# EasyEDA schematic SCH_power_LED_2026-05-29.json
TITLE: lepiTORCH; REV: 1.1; Date: 2026-05-20; Sheet: 1/1; Drawn By: eric
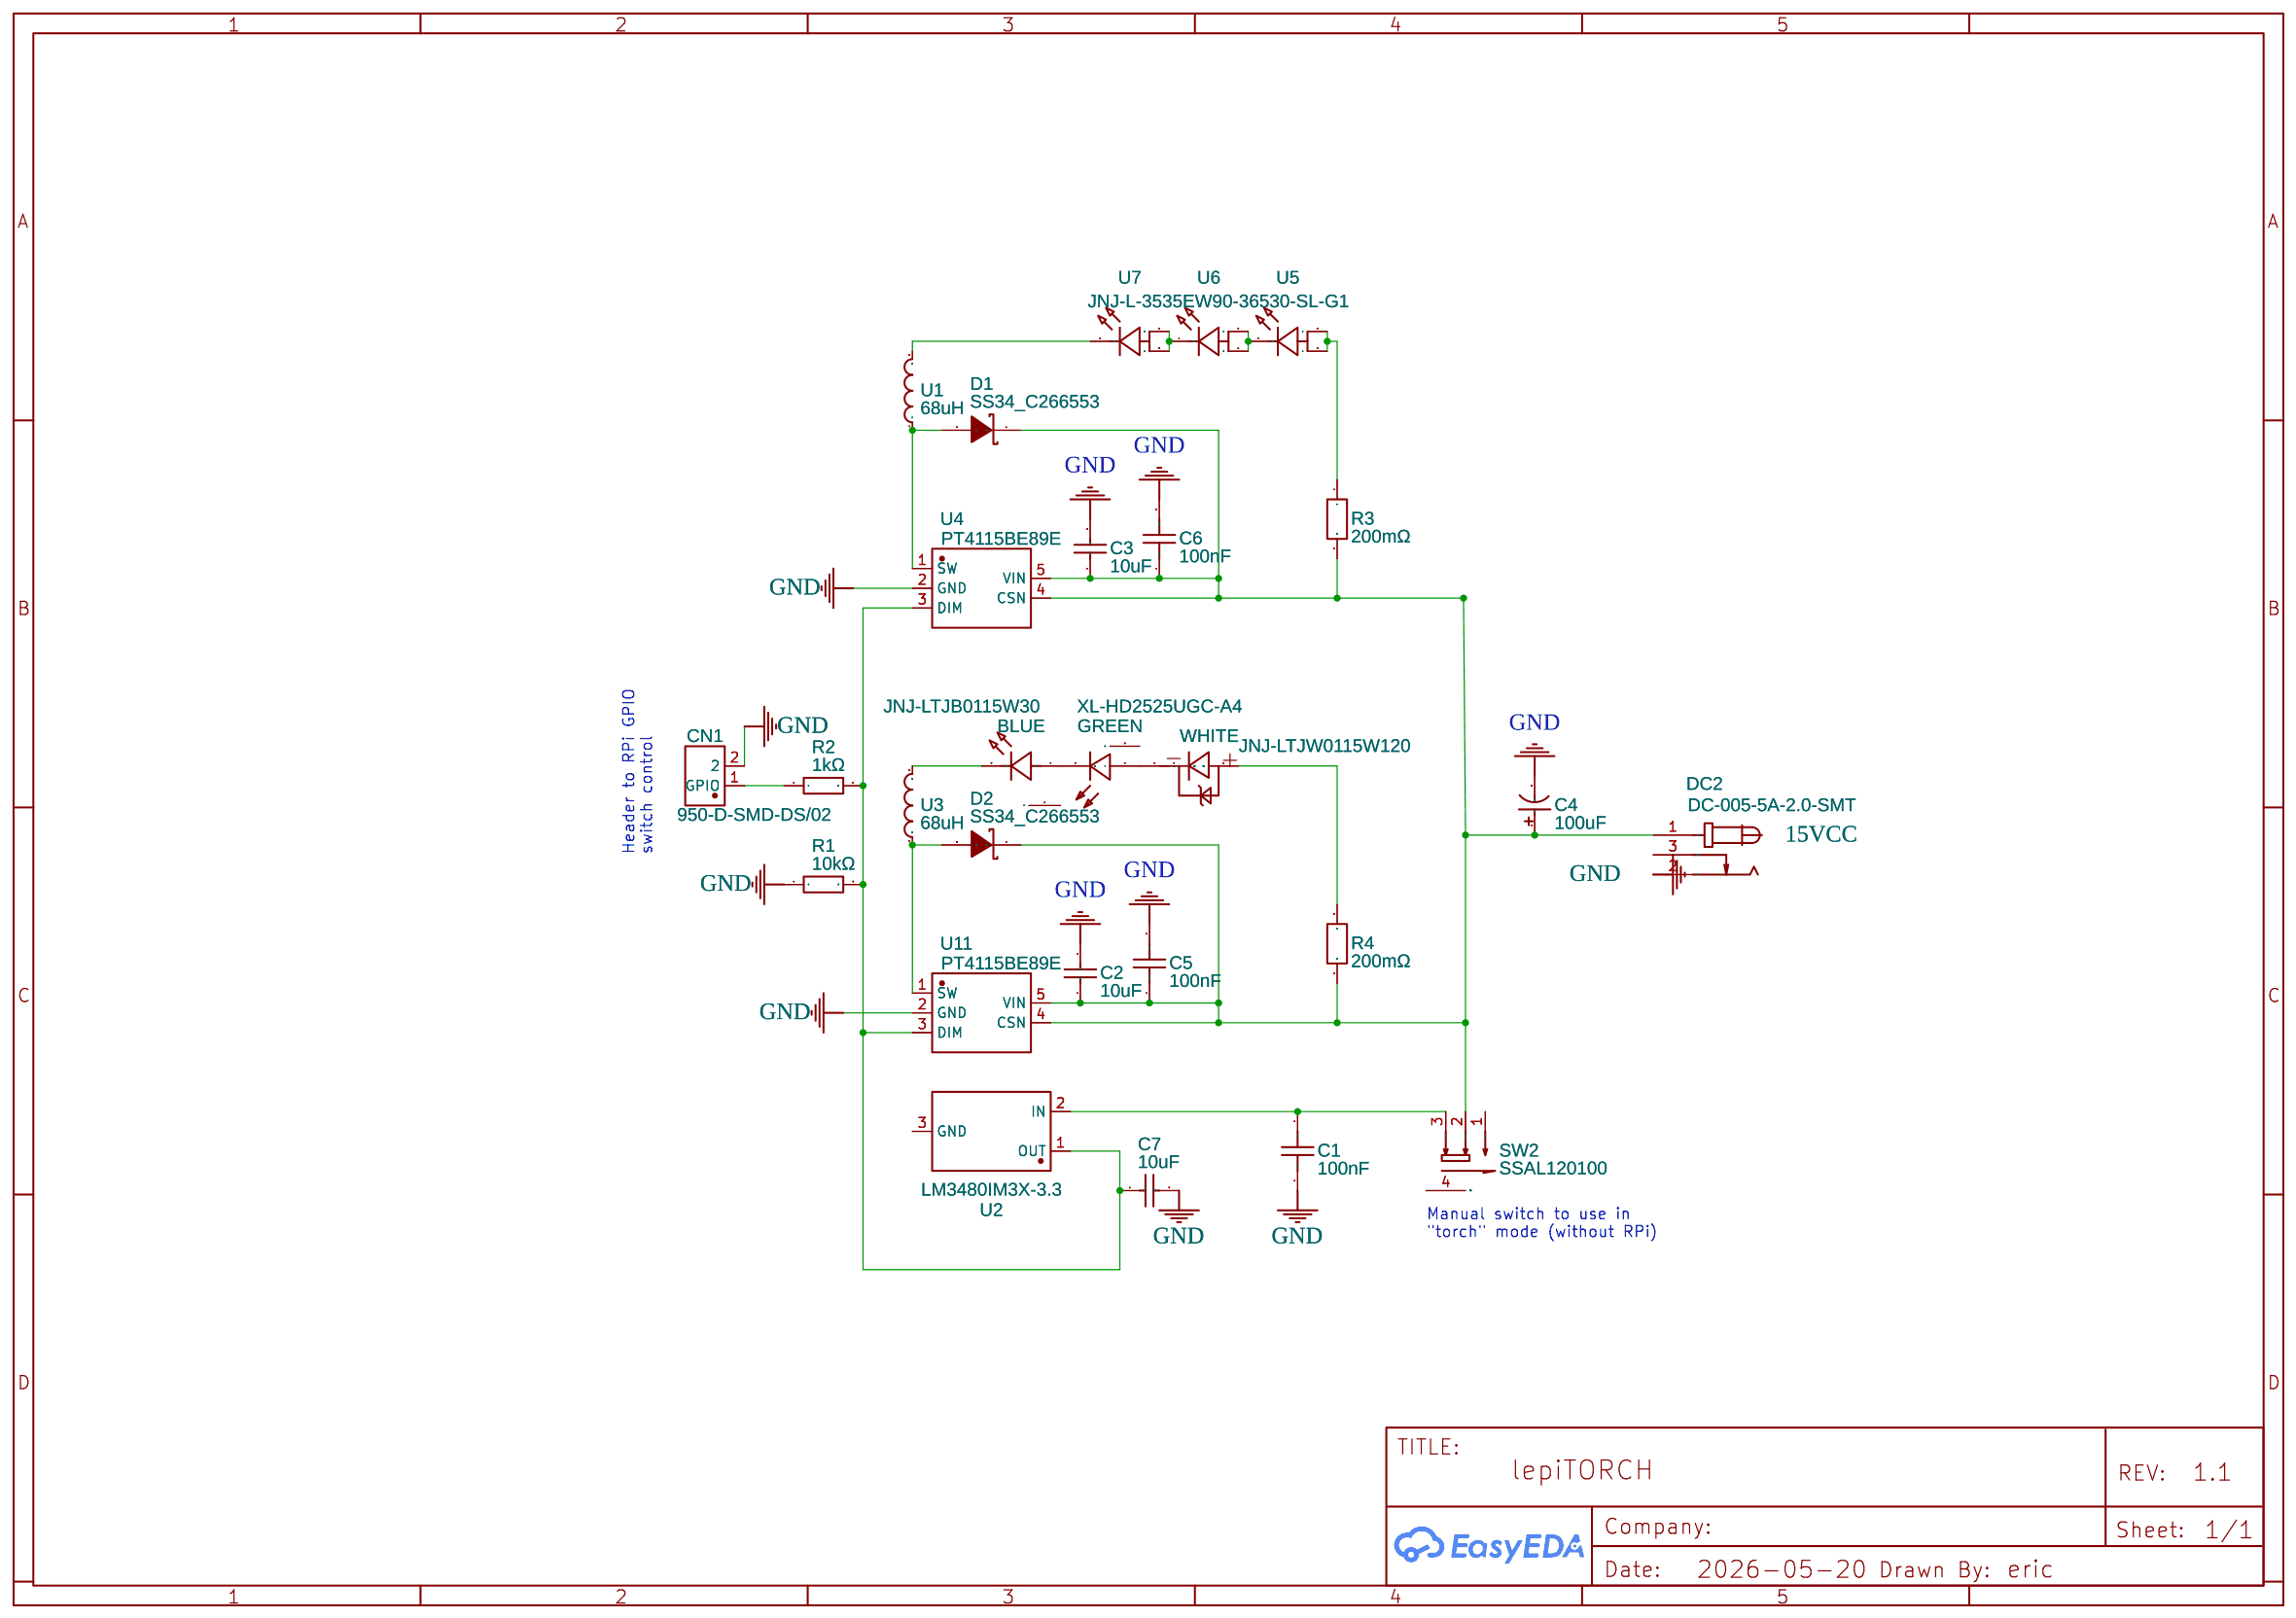
[diagram p0: schematic sheet]

## Parts
BLUE  JNJ-LTJB0115W30  [LED-SMD_3P-L3.5-W3.5-FD-1]
C1  100nF  [C0402]
C2  10uF  [C1206]
C3  10uF  [C1206]
C4  100uF  [CAP-SMD_BD6.3-L6.6-W6.6-LS7.2-R-RD]
C5  100nF  [C0402]
C6  100nF  [C0402]
C7  10uF  [C1206]
CN1  950-D-SMD-DS/02  [CONN-SMD_2P-P5.00_950-D-SMD-DS-02]
D1  SS34_C266553  [SMA_L4.4-W2.8-LS5.4-RD]
D2  SS34_C266553  [SMA_L4.4-W2.8-LS5.4-RD]
DC2  DC-005-5A-2.0-SMT  [DC-IN-TH_DC-005-5A-2.0-SMT]
GREEN  XL-HD2525UGC-A4  [LED-SMD_3P-L2.5-W2.5-FD_C9900052041]
R1  10kΩ  [R0402]
R2  1kΩ  [R0402]
R3  200mΩ  [R0603]
R4  200mΩ  [R0603]
SW2  SSAL120100  [SW-SMD_SSAL120100]
U1  68uH  [IND-SMD_L7.2-W6.6_GPSR07X0]
U2  LM3480IM3X-3.3  [SOT-23-3_L2.9-W1.3-P1.90-LS2.4-BR]
U3  68uH  [IND-SMD_L7.2-W6.6_GPSR07X0]
U4  PT4115BE89E  [SOT-89-5_L4.5-W2.5-P1.50-LS4.6-BL]
U5  JNJ-L-3535EW90-36530-SL-G1  [LED-SMD_3P-L3.5-W3.5_JNJ-L-3535EW90-36530-SL-G1]
U6  JNJ-L-3535EW90-36530-SL-G1  [LED-SMD_3P-L3.5-W3.5_JNJ-L-3535EW90-36530-SL-G1]
U7  JNJ-L-3535EW90-36530-SL-G1  [LED-SMD_3P-L3.5-W3.5_JNJ-L-3535EW90-36530-SL-G1]
U11  PT4115BE89E  [SOT-89-5_L4.5-W2.5-P1.50-LS4.6-BL]
WHITE  JNJ-LTJW0115W120  [LED-SMD_3P-L3.5-W3.5_JNJ-LTJW0115W120]

## Library data of the parts
BLUE = JNJ-LTJB0115W30/56MIL/450-460NM: Supplier: LCSC; Supplier Part: C19185864; Manufacturer: JNJOPTO(强生光电); Manufacturer Part: JNJ-LTJB0115W30/56mil/450-460nm; JLCPCB Part Class: Extended Part; Contributor: lcsc
C1 C5 C6 = GMC04X7R104K25NT: Supplier: LCSC; Supplier Part: C3870400; Manufacturer: CAL-CHIP; JLCPCB Part Class: Extended Part; Contributor: lcsc
C2 C3 C7 = GRM31CR71E106KA12L: Supplier: LCSC; Manufacturer: muRata(村田); Supplier Part: C77093; JLCPCB Part Class: Extended Part
C4 = RVT1E101M0607: Supplier: LCSC; Manufacturer: HONOR(荣誉); Supplier Part: C3338; JLCPCB Part Class: Extended Part
CN1 = 950-D-SMD-DS/02: Supplier: LCSC; Supplier Part: C2974881; Manufacturer: WECO(威克德诺); JLCPCB Part Class: Extended Part; Contributor: lcsc
D1 D2 = SS34_C266553: Contributor: LCSC; Supplier: LCSC; Supplier Part: C266553; Manufacturer: BORN(伯恩半导体); Manufacturer Part: SS34; JLCPCB Part Class: Extended Part
DC2 = DC-005-5A-2.0-SMT: Contributor: LCSC; Supplier: LCSC; Supplier Part: C319134; Manufacturer: XKB Connection(中国星坤); JLCPCB Part Class: Extended Part
GREEN = XL-HD2525UGC-A4: Supplier: LCSC; Supplier Part: C49237859; Manufacturer: XINGLIGHT(成兴光); JLCPCB Part Class: Extended Part; Contributor: lcsc
R1 = TR0402D10KQ1025: Contributor: LCSC; Supplier: LCSC; Supplier Part: C149898; Manufacturer: EVER OHMS(天二科技); Manufacturer Part: TR0402D10K0Q1025Z; JLCPCB Part Class: Extended Part
R2 = QR0402F1KQ10: Contributor: LCSC; Supplier: LCSC; Supplier Part: C176101; Manufacturer: EVER OHMS(天二科技); Manufacturer Part: QR0402F1K00Q10Z; JLCPCB Part Class: Extended Part
R3 R4 = FRL0603FR200TS: Supplier: LCSC; Supplier Part: C3013346; Manufacturer: FOJAN(富捷); JLCPCB Part Class: Extended Part; Contributor: lcsc
SW2 = SSAL120100: Contributor: LCSC; Supplier: LCSC; Supplier Part: C335996; Manufacturer: ALPSALPINE(阿尔卑斯阿尔派); JLCPCB Part Class: Extended Part
U1 U3 = CYA0650-68UH: Supplier: LCSC; Supplier Part: C5189964; Manufacturer: SHOU HAN(首韩); JLCPCB Part Class: Extended Part; Contributor: lcsc
U2 = LM3480IM3X-3.3: Contributor: LCSC; Supplier: LCSC; Supplier Part: C962953; Manufacturer: TI(德州仪器); JLCPCB Part Class: Extended Part
U4 U11 = PT4115BE89E: Supplier: LCSC; Supplier Part: C3039502; Manufacturer: PowTech(华润矽威); JLCPCB Part Class: Extended Part; Contributor: lcsc
U5-U7 = JNJ-L-3535EW90-36530-SL-G1: Supplier: LCSC; Supplier Part: C25170632; Manufacturer: JNJOPTO(强生光电); JLCPCB Part Class: Extended Part; Contributor: lcsc
WHITE = JNJ-LTJW0115W120/63MIL/6500-7000K: Supplier: LCSC; Supplier Part: C19185884; Manufacturer: JNJOPTO(强生光电); Contributor: lcsc; JLCPCB Part Class: Extended Part

## Nets
GND: C1.1 C2.2 C3.2 C4.2 C5.2 C6.2 C7.2 CN1.2 DC2.2 R1.1 U4.2(GND) U11.2(GND)
Net-(BLUE-1): BLUE.1(A) GREEN.1(C)
Net-(BLUE-2): BLUE.2(K) U3.2
Net-(C1-2): C1.2 SW2.3 U2.2(IN)
Net-(C2-1): C2.1 C3.1 C4.1 C5.1 C6.1 D1.1(C) D2.1(C) DC2.1 R3.2 R4.2 SW2.2 U4.4(CSN) U4.5(VIN) U11.4(CSN) U11.5(VIN)
Net-(C7-1): C7.1 R1.2 R2.2 U2.1(OUT) U4.3(DIM) U11.3(DIM)
Net-(CN1-1): CN1.1(GPIO) R2.1
Net-(D1-2): D1.2(A) U1.1 U4.1(SW)
Net-(D2-2): D2.2(A) U3.1 U11.1(SW)
Net-(GREEN-2): GREEN.2(A) WHITE.1(Cathode)
Net-(R3-1): R3.1 U5.2(A) U5.3(A)
Net-(R4-1): R4.1 WHITE.3(Anode)
Net-(U1-2): U1.2 U7.1(C)
Net-(U5-1): U5.1(C) U6.2(A) U6.3(A)
Net-(U6-1): U6.1(C) U7.2(A) U7.3(A)

Not connected (* = marked no-connect by the designer): BLUE 3(A); DC2 3; GREEN 3; SW2 1 4(SHELL); U2 3(GND); WHITE 2(Cathode)

## Notes on the sheet
- Header to RPi GPIO
  switch control
- Manual switch to use in
  "torch" mode (without RPi)
